# Altium schematic sheet disch.SchDoc: Discharge
size A; Organization: Cal Poly Racing; engineer1: Graydon Wilson; engineer2: Jason Childers; engineer3: Haley Pierce
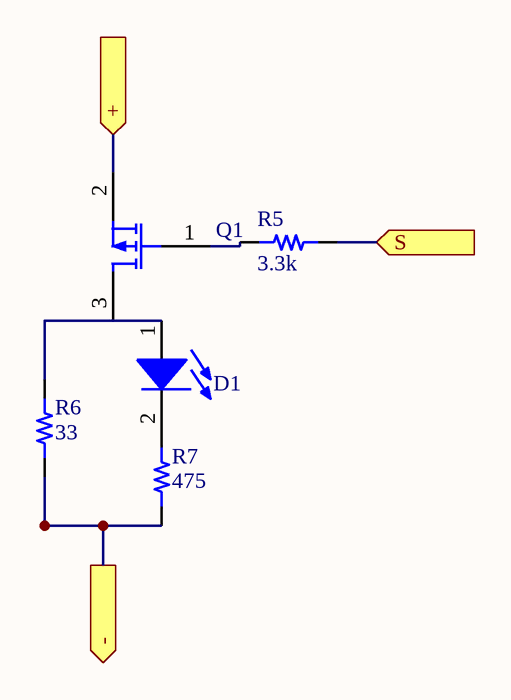
[diagram p0: disch.SchDoc]

## Parts
D1  LED  [0805_LED]  (value not drawn)
Q1  CMUDM8005 TR PFET  [CMUDM8005 TR SOT523]  (value not drawn)
R5  3.3k  [RES 0603/1608]
R6  33  [RES 2512/6332]
R7  475  [RES 0603/1608]

## Ports
+ (in), - (out), S (in)

## Nets
+: Q1.2(S) ; port +
-: R6.2 R7.2 ; port -
S: R5.2 ; port S
NetD1_1: D1.1(A) Q1.3(D) R6.1
NetD1_2: D1.2(K) R7.1
NetQ1_1: Q1.1(G) R5.1

## Notes on the sheet
- Date:
- Time:
- File:

## Library data of the parts
D1 = 19: Generic 0805 LED; id: 19; vr: 1; name: 0805 LED; numcircuits: 1; package: 0805; quantity: 0
Q1 = 13: MOSFET P-CH 20V 650MA SOT523; id: 13; type: P_Channel; vdsmax: 0; numcircuits: 1; rdson: 360m; vgsmax: 8; name: CMUDM8005 TR PFET; current: 650mA; package: SOT-523; quantity: 0; link: https://www.digikey.com/product-detail/en/central-semiconductor-corp/CMUDM8005-TR/CMUDM8005CT-ND/5324590
R5 R7 = 1: id: 1; name: 0603 Resistor; percent tolerance: 5; package: 0603; quantity: 0
  R5: resistance: 3.3k
  R7: resistance: 475
R6 = 4: id: 4; name: 2512 Resistor; percent tolerance: 5; resistance: 33; package: 2512; quantity: 0; createdby: Kevin